# Altium schematic sheet 3_Motor.SchDoc
size A4; SheetNumber: 3; SheetTotal: 4
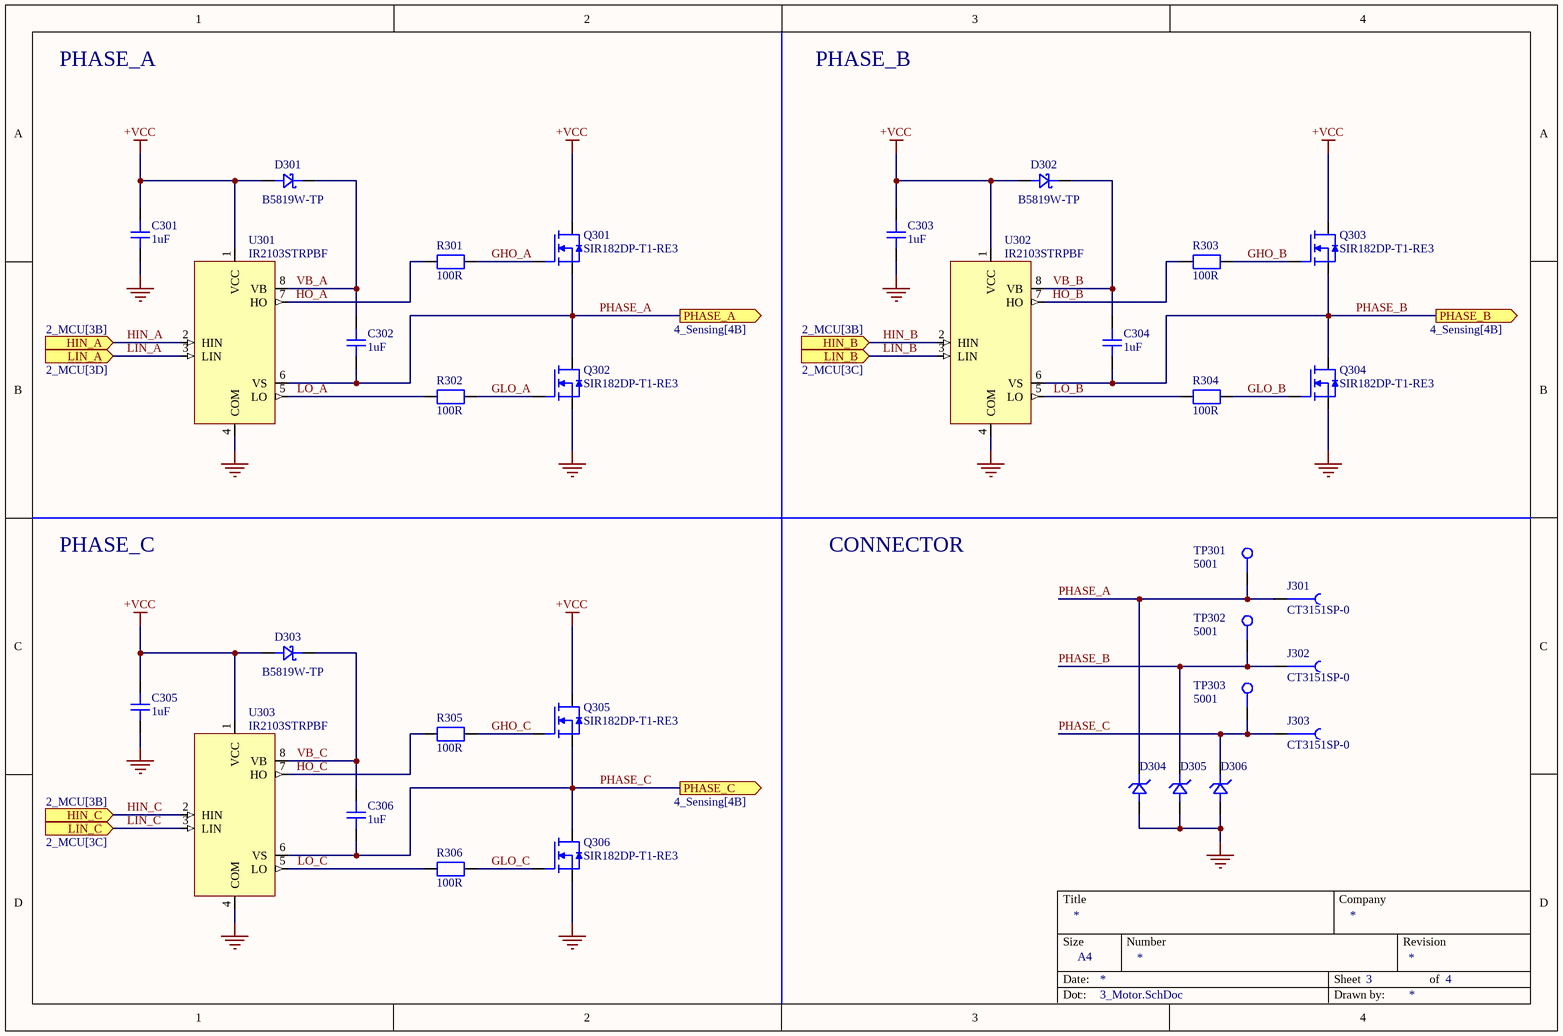
[diagram p0: 3_Motor.SchDoc]

## Parts
C301  value 1uF  [C_Yageo_CC_0603_A]  (hidden comment: CC0603KRX7R7BB105)
C302  value 1uF  [C_Yageo_CC_0603_A]  (hidden comment: CC0603KRX7R7BB105)
C303  value 1uF  [C_Yageo_CC_0603_A]  (hidden comment: CC0603KRX7R7BB105)
C304  value 1uF  [C_Yageo_CC_0603_A]  (hidden comment: CC0603KRX7R7BB105)
C305  value 1uF  [C_Yageo_CC_0603_A]  (hidden comment: CC0603KRX7R7BB105)
C306  value 1uF  [C_Yageo_CC_0603_A]  (hidden comment: CC0603KRX7R7BB105)
D301  B5819W-TP  [D_Schottky_MCC_SOD-123]
D302  B5819W-TP  [D_Schottky_MCC_SOD-123]
D303  B5819W-TP  [D_Schottky_MCC_SOD-123]
D304  SMBJ15A-13-F  [D_TVS_Uni_Diodes_DO-214AA_B]  (value not drawn)
D305  SMBJ15A-13-F  [D_TVS_Uni_Diodes_DO-214AA_B]  (value not drawn)
D306  SMBJ15A-13-F  [D_TVS_Uni_Diodes_DO-214AA_B]  (value not drawn)
J301  CT3151SP-0  [J_CalTest_CT3151SP-0]
J302  CT3151SP-0  [J_CalTest_CT3151SP-0]
J303  CT3151SP-0  [J_CalTest_CT3151SP-0]
Q301  SIR182DP-T1-RE3  [Q_Vishay_PowerPACK-SO-8-Single]
Q302  SIR182DP-T1-RE3  [Q_Vishay_PowerPACK-SO-8-Single]
Q303  SIR182DP-T1-RE3  [Q_Vishay_PowerPACK-SO-8-Single]
Q304  SIR182DP-T1-RE3  [Q_Vishay_PowerPACK-SO-8-Single]
Q305  SIR182DP-T1-RE3  [Q_Vishay_PowerPACK-SO-8-Single]
Q306  SIR182DP-T1-RE3  [Q_Vishay_PowerPACK-SO-8-Single]
R301  value 100R  [R_Yageo_RCL_1206_A]  (hidden comment: RC1206FR-07100RL)
R302  value 100R  [R_Yageo_RCL_1206_A]  (hidden comment: RC1206FR-07100RL)
R303  value 100R  [R_Yageo_RCL_1206_A]  (hidden comment: RC1206FR-07100RL)
R304  value 100R  [R_Yageo_RCL_1206_A]  (hidden comment: RC1206FR-07100RL)
R305  value 100R  [R_Yageo_RCL_1206_A]  (hidden comment: RC1206FR-07100RL)
R306  value 100R  [R_Yageo_RCL_1206_A]  (hidden comment: RC1206FR-07100RL)
TP301  5001  [TP_Keystone_TH]
TP302  5001  [TP_Keystone_TH]
TP303  5001  [TP_Keystone_TH]
U301  IR2103STRPBF  [U_Infineon_8-SOIC_3.9mm]
U302  IR2103STRPBF  [U_Infineon_8-SOIC_3.9mm]
U303  IR2103STRPBF  [U_Infineon_8-SOIC_3.9mm]

## Ports
HIN_A (in, see 2_MCU[3B]), HIN_B (in, see 2_MCU[3B]), HIN_C (in, see 2_MCU[3B]), LIN_A (in, see 2_MCU[3D]), LIN_B (in, see 2_MCU[3C]), LIN_C (in, see 2_MCU[3C]), PHASE_A (out, see 4_Sensing[4B]), PHASE_B (out, see 4_Sensing[4B]), PHASE_C (out, see 4_Sensing[4B])

## Nets
+VCC: C301.2 C303.2 C305.2 D301.2 D302.2 D303.2 Q301.1(D) Q303.1(D) Q305.1(D) U301.1(VCC) U302.1(VCC) U303.1(VCC)
GND: C301.1 C303.1 C305.1 D304.2 D305.2 D306.2 Q302.3(S) Q304.3(S) Q306.3(S) U301.4(COM) U302.4(COM) U303.4(COM)
GHO_A: Q301.2(G) R301.2
GHO_B: Q303.2(G) R303.2
GHO_C: Q305.2(G) R305.2
GLO_A: Q302.2(G) R302.2
GLO_B: Q304.2(G) R304.2
GLO_C: Q306.2(G) R306.2
HIN_A: U301.2(HIN) ; port HIN_A
HIN_B: U302.2(HIN) ; port HIN_B
HIN_C: U303.2(HIN) ; port HIN_C
HO_A: R301.1 U301.7(HO)
HO_B: R303.1 U302.7(HO)
HO_C: R305.1 U303.7(HO)
LIN_A: U301.3(LIN) ; port LIN_A
LIN_B: U302.3(LIN) ; port LIN_B
LIN_C: U303.3(LIN) ; port LIN_C
LO_A: R302.1 U301.5(LO)
LO_B: R304.1 U302.5(LO)
LO_C: R306.1 U303.5(LO)
PHASE_A: C302.1 D304.1 J301.1 Q301.3(S) Q302.1(D) TP301.1 U301.6(VS) ; port PHASE_A
PHASE_B: C304.1 D305.1 J302.1 Q303.3(S) Q304.1(D) TP302.1 U302.6(VS) ; port PHASE_B
PHASE_C: C306.1 D306.1 J303.1 Q305.3(S) Q306.1(D) TP303.1 U303.6(VS) ; port PHASE_C
VB_A: C302.2 D301.1 U301.8(VB)
VB_B: C304.2 D302.1 U302.8(VB)
VB_C: C306.2 D303.1 U303.8(VB)

## Notes on the sheet
- PHASE_A
- PHASE_B
- PHASE_C
- CONNECTOR
- Title
- Company
- Size
- Date:
- A4
- Number
- Sheet
- Revision
- of
- Doc:
- Drawn by:

## Library data of the parts
C301-C306 = CMP-001-00019-3: Multilayer Ceramic Capacitor, 1 uF, 16 V, ± 10%, X7R, 0603 [1608 Metric]; Voltage: 16V; Dissipation Factor: 5%; Case Code (Imperial): 0603; ComponentLink1URL: https://www.yageo.com/upload/media/product/productsearch/datasheet/mlcc/UPY-GPHC_X7R_6.3V-to-250V_24.pdf; Pins: 2; Width: 0.031inch; Tolerance: 10%; Height: 0.8mm; Radiation Hardening: No; Lead Free: Lead Free; Material: Ceramic; Reach SVHC Compliant: Unknown; Case Code (Metric): 1608; Min Operating Temperature: -55°C; Case/Package: 0603; Package Quantity: 1; Thickness: 0.035inch; Packaging: Tape and Reel; Series: CC; Termination: SMD/SMT; Max Operating Temperature: 125°C; Construction: Flat; Depth: 0.8mm; Halogen Free: Halogen Free; RoHS Compliant: Yes; Voltage Rating (DC): 16V; Dielectric: X7R; Length: 1.6mm; Voltage Rating: 16V; Mounting Technology: Surface Mount; ComponentLink1Description: Datasheet
D301-D303 = CMP-000001-1: Rectifier Diode, Schottky, 1 Phase, 1 Element, 1A, 40V V(RRM), Silicon; Max Reverse Voltage (DC): 20V; Max Forward Surge Current (Ifsm): 10A; Forward Voltage: 550mV; Max Reverse Current: 1mA; Max Power Dissipation: 250mW; Packaging: Tape and Reel; ComponentLink1Description: Datasheet; Max Operating Temperature: 125°C; Mounting Technology: Surface Mount; RoHS Compliant: Yes; Forward Current: 1A; Average Rectified Current: 1A; Series: -; Min Operating Temperature: -65°C; ComponentLink1URL: https://www.mccsemi.com/pdf/Products/B5817W-B5819W(SOD-123).pdf; Max Repetitive Reverse Voltage (Vrrm): 40V; Package Quantity: 3000; Reverse Voltage (DC): 40V
D304-D306 = CMP-004-00005-1: TVS Diode Single Uni-Dir 15V 600W 2-Pin SMB T/R / TVS DIODE 15VWM 24.4VC SMB; Max Reverse Leakage Current: 5uA; Max Surge Current: 24A; Diode Type: ZENER; Power Line Protection: No; Direction: Unidirectional; Breakdown Voltage: 19.2V; Clamping Voltage: 24.4V; Value: 800pF; Min Breakdown Voltage: 16.7V; Number of Unidirectional Channels: 1; Forward Voltage: 5V; Test Current: 1mA; Working Voltage: 15V; Max Power Dissipation: 600W; Reverse Standoff Voltage: 15V; Case/Package: SMB; Max Operating Temperature: 150°C; Mounting Technology: Surface Mount; Peak Pulse Current: 24A; Packaging: Tape and Reel; RoHS Compliant: Yes; Package Quantity: 3000; Series: SMBJ; Termination: SMD/SMT; Polarity: Unidirectional; Peak Pulse Power: 600W; Min Operating Temperature: -55°C; Clamping Voltage-Max: 24.4V; Height: 2.62mm; Lead Free: Lead Free; Leakage Current: 5uA; Length: 4.57mm; Max Breakdown Voltage: 19.2V; Max Output current: 24A; Number of Elements: 1; Pins: 2; Power Dissipation: 600W; Radiation Hardening: No; Reverse Breakdown Voltage: 16.7V; Voltage Rating (DC): 15V; Width: 3.9mm
J301-J303 = CMP-002-00000-13: Conn 4mm Safety Banana Jack F 1 POS Solder RA Thru-Hole 1 Port Bag; pin to pad: 1>1+2+3+4; Gender: Female; Insulation: Mating End Insulated; Body Material: Nylon,Polyamide,PA66; Series: Cal Test; Max Operating Temperature: 80°C; Termination: Solder; ComponentLink1URL: https://mm.digikey.com/Volume0/opasdata/d220001/medias/docus/4846/DS_1768_Catalog.pdf; ComponentLink1Description: Datasheet; Contact Plating: Nickel; Mounting Technology: Through Hole,Panel; Min Operating Temperature: -20°C; Contact Material: Brass; Packaging: Bulk; Color: Black
Q301-Q306 = CMP-013-00000-4: TrenchFET Gen IV Power MOSFET N-Channel Single 60V VDS ±20V VGS 60A ID 8-Pin PowerPAK SOIC T/R; pin to pad: 1>5 2>4 3>1+2+3; Rds On Max: 2.8mR; Max Power Dissipation: 69.4W; Input Capacitance: 3.25nF; Continuous Drain Current (ID): 60A; Max Operating Temperature: 150°C; Mounting Technology: Surface Mount; ComponentLink1URL: https://www.vishay.com/docs/77800/sir182dp.pdf; ComponentLink1Description: Datasheet; Drain to Source Voltage (Vdss): 60V; Packaging: Cut Tape; Series: TrenchFET® Gen IV; Min Operating Temperature: -55°C
R301-R306 = CMP-009-00004-10: SMD Chip Resistor, 100 Ohm, ± 1%, 250 mW, 1206 [3216 Metric], Thick Film, General Purpose; Max Power Dissipation: 250mW; Voltage Rating (AC): 200V; Temperature Coefficient: 100ppm/°C; Series: RC; Tolerance: 1%; Width: 1.6mm; Lead Free: Lead Free; Number of Terminations: 2; Termination: SMD/SMT; Case/Package: 1206; Height: 0.55mm; Case Code (Metric): 3216; Reach SVHC Compliant: Unknown; ComponentLink1Description: Datasheet; Technology: THICK FILM; Voltage Rating: 200V; Features: Moisture Resistant; Power Rating: 250mW; Min Operating Temperature: -55°C; Package Quantity: 5000; RoHS Compliant: Yes; Packaging: Tape and Reel; Depth: 1.6mm; Length: 3.1mm; Resistance Tolerance: 1%; Max Operating Temperature: 155°C; Case Code (Imperial): 1206; ComponentLink1URL: https://www.yageo.com/upload/media/product/products/datasheet/rchip/PYu-RC_Group_51_RoHS_L_12.pdf; Resistor Type: Thick Film
TP301-TP303 = CMP-000000-3: TEST POINT, PCB, THROUGH HOLE; Product R; Range: -; Connector Colour: Black; Mounting: Through Hole; Body Material: Bronze; Insulation: Insulated; Plating: Silver; Number of Ports: 1; Inside Diameter: 1.27mm; Hole Diameter: 1.6mm; Outside Diameter: 2.54mm; Lead Free: Lead Free; Series: THM; Mounting Technology: Through Hole; Material: Nylon,Bronze,Silver; Color: Black; Packaging: Bulk; ComponentLink1URL: https://www.keyelco.com/userAssets/file/M65p56.pdf; Housing Color: Black; Reach SVHC Compliant: No; ComponentLink1Description: Datasheet; RoHS Compliant: Yes; Termination: Through Hole; Contact Plating: Tin,Silver; Diameter: 2.54mm; Insulation Material: Nylon; Contact Material: Bronze; Orientation: Straight; Number of Contacts: 1; Length: 7.62mm; Package Quantity: 100
U301-U303 = CMP-024-00000-4: 600 V half-bridge gate driver IC with shoot through protection, SOIC 8N, RoHS; Number of Outputs: 2; Max Supply Voltage: 20V; Propagation Delay: 680ns; Fall Time: 60ns; Channel Type: Independent; Output Current: 360mA; Mounting Technology: Surface Mount; Case/Package: SOIC; ComponentLink1Description: Datasheet; ComponentLink1URL: https://www.infineon.com/dgdl/ir2103.pdf?fileId=5546d462533600a4015355c7b54b166f; Width: 0.157inch; Halogen Free: Not Halogen Free; Height: 0.059inch; Number of Channels: 2; Series: -; Pins: 8; Lead Free: Lead Free; Length: 0.196inch; RoHS Compliant: Yes; Max Operating Temperature: 150°C; Number of Drivers: 2; Min Operating Temperature: -40°C; Max Output current: 360mA; Packaging: Cut Tape